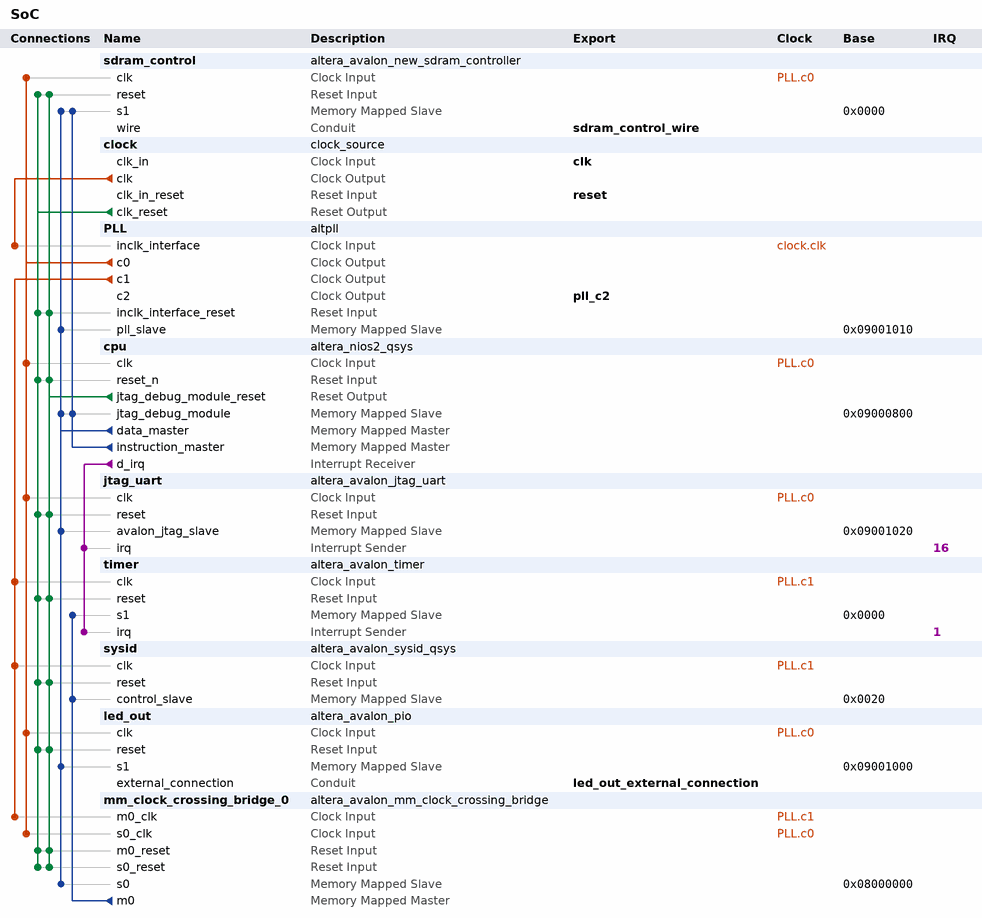
[diagram p0: system contents]
# Platform Designer (Qsys) system SoC, Cyclone IV E EP4CE115F29C7
# Parameters at their usual value, and those the tool derives, are not listed.
package require -exact qsys 12.1
create_system SoC
set_project_property DEVICE_FAMILY {Cyclone IV E}
set_project_property DEVICE EP4CE115F29C7

add_instance sdram_control altera_avalon_new_sdram_controller 12.1
set_instance_parameter_value sdram_control TAC 6.0
set_instance_parameter_value sdram_control TRCD 20.0
set_instance_parameter_value sdram_control TRP 20.0
set_instance_parameter_value sdram_control casLatency 3
set_instance_parameter_value sdram_control columnWidth 10
set_instance_parameter_value sdram_control dataWidth 32
set_instance_parameter_value sdram_control generateSimulationModel false
set_instance_parameter_value sdram_control model custom
set_instance_parameter_value sdram_control numberOfBanks 4
set_instance_parameter_value sdram_control numberOfChipSelects 1
set_instance_parameter_value sdram_control powerUpDelay 100.0
set_instance_parameter_value sdram_control refreshPeriod 15.625
set_instance_parameter_value sdram_control rowWidth 13

add_instance clock clock_source 12.1
set_instance_parameter_value clock clockFrequency 50000000

add_instance PLL altpll 12.1
set_instance_parameter_value PLL INCLK0_INPUT_FREQUENCY 20000
set_instance_parameter_value PLL CLK0_MULTIPLY_BY 2
set_instance_parameter_value PLL CLK1_MULTIPLY_BY 1
set_instance_parameter_value PLL CLK2_MULTIPLY_BY 2
set_instance_parameter_value PLL CLK0_DIVIDE_BY 1
set_instance_parameter_value PLL CLK1_DIVIDE_BY 5
set_instance_parameter_value PLL CLK2_DIVIDE_BY 1
set_instance_parameter_value PLL CLK1_PHASE_SHIFT 0
set_instance_parameter_value PLL CLK2_PHASE_SHIFT -1806
set_instance_parameter_value PLL CLK1_DUTY_CYCLE 50
set_instance_parameter_value PLL CLK2_DUTY_CYCLE 50
set_instance_parameter_value PLL PORT_clk1 PORT_USED
set_instance_parameter_value PLL PORT_clk2 PORT_USED
set_instance_parameter_value PLL PORT_clk3 PORT_UNUSED
set_instance_parameter_value PLL PORT_ARESET PORT_UNUSED
set_instance_parameter_value PLL PORT_LOCKED PORT_UNUSED

add_instance cpu altera_nios2_qsys 12.1
set_instance_parameter_value cpu resetSlave sdram_control.s1
set_instance_parameter_value cpu exceptionSlave sdram_control.s1
set_instance_parameter_value cpu breakSlave cpu.jtag_debug_module
set_instance_parameter_value cpu muldiv_multiplierType NoneSmall
set_instance_parameter_value cpu impl Small
set_instance_parameter_value cpu icache_size 4096

add_instance jtag_uart altera_avalon_jtag_uart 12.1
set_instance_parameter_value jtag_uart simInteractiveOptions INTERACTIVE_ASCII_OUTPUT

add_instance timer altera_avalon_timer 12.1
set_instance_parameter_value timer period 1
set_instance_parameter_value timer periodUnits MSEC
set_instance_parameter_value timer timerPreset FULL_FEATURED

add_instance sysid altera_avalon_sysid_qsys 12.1
set_instance_parameter_value sysid id 0

add_instance led_out altera_avalon_pio 12.1
set_instance_parameter_value led_out direction Output
set_instance_parameter_value led_out width 8

add_instance mm_clock_crossing_bridge_0 altera_avalon_mm_clock_crossing_bridge 12.1
set_instance_parameter_value mm_clock_crossing_bridge_0 DATA_WIDTH 32
set_instance_parameter_value mm_clock_crossing_bridge_0 ADDRESS_WIDTH 10
set_instance_parameter_value mm_clock_crossing_bridge_0 MAX_BURST_SIZE 1
set_instance_parameter_value mm_clock_crossing_bridge_0 COMMAND_FIFO_DEPTH 4
set_instance_parameter_value mm_clock_crossing_bridge_0 RESPONSE_FIFO_DEPTH 4
set_instance_parameter_value mm_clock_crossing_bridge_0 MASTER_SYNC_DEPTH 2
set_instance_parameter_value mm_clock_crossing_bridge_0 SLAVE_SYNC_DEPTH 2

# connections
add_connection clock.clk PLL.inclk_interface clock
add_connection PLL.c0 cpu.clk clock
add_connection PLL.c0 jtag_uart.clk clock
add_connection PLL.c0 led_out.clk clock
add_connection PLL.c0 mm_clock_crossing_bridge_0.s0_clk clock
add_connection PLL.c0 sdram_control.clk clock
add_connection PLL.c1 mm_clock_crossing_bridge_0.m0_clk clock
add_connection PLL.c1 sysid.clk clock
add_connection PLL.c1 timer.clk clock
add_connection clock.clk_reset cpu.reset_n reset
add_connection clock.clk_reset jtag_uart.reset reset
add_connection clock.clk_reset led_out.reset reset
add_connection clock.clk_reset mm_clock_crossing_bridge_0.m0_reset reset
add_connection clock.clk_reset mm_clock_crossing_bridge_0.s0_reset reset
add_connection clock.clk_reset PLL.inclk_interface_reset reset
add_connection clock.clk_reset sdram_control.reset reset
add_connection clock.clk_reset sysid.reset reset
add_connection clock.clk_reset timer.reset reset
add_connection cpu.jtag_debug_module_reset cpu.reset_n reset
add_connection cpu.jtag_debug_module_reset jtag_uart.reset reset
add_connection cpu.jtag_debug_module_reset led_out.reset reset
add_connection cpu.jtag_debug_module_reset mm_clock_crossing_bridge_0.m0_reset reset
add_connection cpu.jtag_debug_module_reset mm_clock_crossing_bridge_0.s0_reset reset
add_connection cpu.jtag_debug_module_reset PLL.inclk_interface_reset reset
add_connection cpu.jtag_debug_module_reset sdram_control.reset reset
add_connection cpu.jtag_debug_module_reset sysid.reset reset
add_connection cpu.jtag_debug_module_reset timer.reset reset
add_connection cpu.data_master cpu.jtag_debug_module avalon
set_connection_parameter_value cpu.data_master/cpu.jtag_debug_module baseAddress 0x09000800
add_connection cpu.data_master jtag_uart.avalon_jtag_slave avalon
set_connection_parameter_value cpu.data_master/jtag_uart.avalon_jtag_slave baseAddress 0x09001020
add_connection cpu.data_master led_out.s1 avalon
set_connection_parameter_value cpu.data_master/led_out.s1 baseAddress 0x09001000
add_connection cpu.data_master mm_clock_crossing_bridge_0.s0 avalon
set_connection_parameter_value cpu.data_master/mm_clock_crossing_bridge_0.s0 baseAddress 0x08000000
add_connection cpu.data_master PLL.pll_slave avalon
set_connection_parameter_value cpu.data_master/PLL.pll_slave baseAddress 0x09001010
add_connection cpu.data_master sdram_control.s1 avalon
set_connection_parameter_value cpu.data_master/sdram_control.s1 baseAddress 0x0000
add_connection cpu.instruction_master cpu.jtag_debug_module avalon
set_connection_parameter_value cpu.instruction_master/cpu.jtag_debug_module baseAddress 0x09000800
add_connection cpu.instruction_master sdram_control.s1 avalon
set_connection_parameter_value cpu.instruction_master/sdram_control.s1 baseAddress 0x0000
add_connection mm_clock_crossing_bridge_0.m0 sysid.control_slave avalon
set_connection_parameter_value mm_clock_crossing_bridge_0.m0/sysid.control_slave baseAddress 0x0020
add_connection mm_clock_crossing_bridge_0.m0 timer.s1 avalon
set_connection_parameter_value mm_clock_crossing_bridge_0.m0/timer.s1 baseAddress 0x0000
add_connection cpu.d_irq jtag_uart.irq interrupt
set_connection_parameter_value cpu.d_irq/jtag_uart.irq irqNumber 16
add_connection cpu.d_irq timer.irq interrupt
set_connection_parameter_value cpu.d_irq/timer.irq irqNumber 1

# exported interfaces
add_interface clk clock sink
set_interface_property clk EXPORT_OF clock.clk_in
add_interface reset reset sink
set_interface_property reset EXPORT_OF clock.clk_in_reset
add_interface led_out_external_connection conduit end
set_interface_property led_out_external_connection EXPORT_OF led_out.external_connection
add_interface sdram_control_wire conduit end
set_interface_property sdram_control_wire EXPORT_OF sdram_control.wire
add_interface pll_c2 clock source
set_interface_property pll_c2 EXPORT_OF PLL.c2

save_system SoC.qsys
